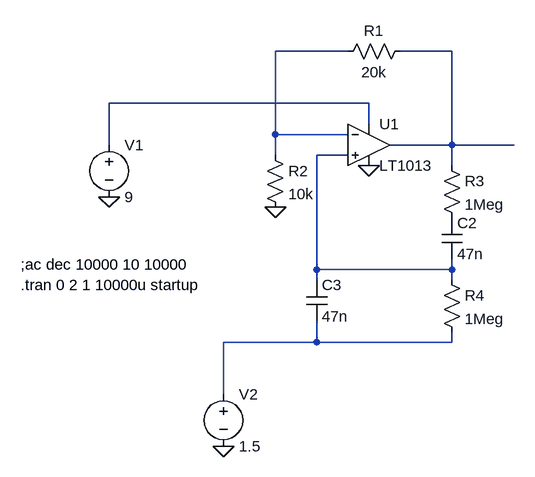
[diagram p0: schematic runooffgroove_tri_vibe_generator3.asc]
runooffgroove_tri_vibe_generator3.asc, the LTspice schematic file:
Version 4
SHEET 1 2708 680
WIRE 1120 -384 1008 -384
WIRE 1280 -384 1200 -384
WIRE 1152 -304 752 -304
WIRE 1152 -272 1152 -304
WIRE 1008 -256 1008 -384
WIRE 1120 -256 1008 -256
WIRE 752 -240 752 -304
WIRE 1280 -240 1280 -384
WIRE 1280 -240 1184 -240
WIRE 1376 -240 1280 -240
WIRE 1008 -224 1008 -256
WIRE 1120 -224 1072 -224
WIRE 1280 -208 1280 -240
WIRE 1072 -48 1072 -224
WIRE 1280 -48 1280 -64
WIRE 1280 -48 1072 -48
WIRE 1072 -32 1072 -48
WIRE 1280 -32 1280 -48
WIRE 1072 64 1072 32
WIRE 1072 64 928 64
WIRE 1280 64 1280 48
WIRE 1280 64 1072 64
WIRE 928 144 928 64
FLAG 752 -160 0
FLAG 1152 -208 0
FLAG 1008 -144 0
FLAG 928 224 0
SYMBOL voltage 752 -256 R0
WINDOW 123 0 0 Left 2
WINDOW 39 0 0 Left 2
SYMATTR InstName V1
SYMATTR Value 9
SYMBOL res 1216 -400 R90
WINDOW 0 0 56 VBottom 2
WINDOW 3 32 56 VTop 2
SYMATTR InstName R1
SYMATTR Value 20k
SYMBOL res 992 -240 R0
SYMATTR InstName R2
SYMATTR Value 10k
SYMBOL res 1264 -224 R0
SYMATTR InstName R3
SYMATTR Value 1Meg
SYMBOL cap 1264 -128 R0
SYMATTR InstName C2
SYMATTR Value 47n
SYMBOL res 1264 -48 R0
SYMATTR InstName R4
SYMATTR Value 1Meg
SYMBOL cap 1056 -32 R0
SYMATTR InstName C3
SYMATTR Value 47n
SYMBOL voltage 928 128 R0
WINDOW 123 0 0 Left 2
WINDOW 39 0 0 Left 2
SYMATTR InstName V2
SYMATTR Value 1.5
SYMBOL Opamps\\LT1013 1152 -304 R0
SYMATTR InstName U1
TEXT 616 -24 Left 2 !.tran 0 2 1 10000u startup
TEXT 616 -56 Left 2 !;ac dec 10000 10 10000

The netlist it stands for:
* runooffgroove_tri_vibe_generator3.asc
V1 N003 0 9
R1 N002 N001 20k
R2 N001 0 10k
R3 N002 P001 1Meg
C2 P001 N004 47n
R4 N004 N005 1Meg
C3 N004 N005 47n
V2 N005 0 1.5
XU1 N004 N001 N003 0 N002 LT1013  ; pins In+ In- V+ V- OUT
.tran 0 2 1 10000u startup
;ac dec 10000 10 10000
.lib LTC.lib
.backanno
.end